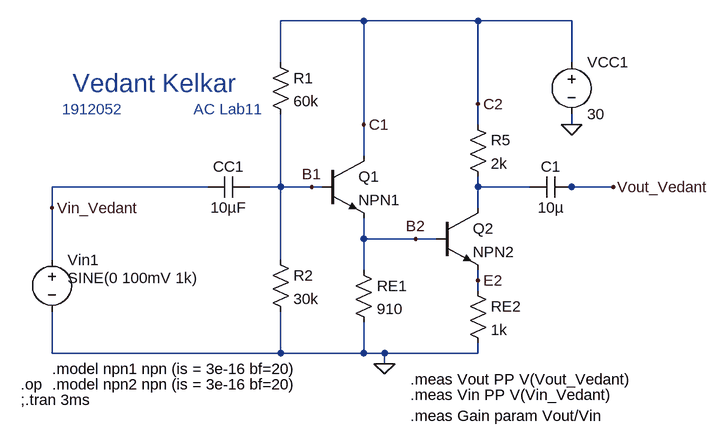
[diagram p0: schematic AC_Lab11.asc]
AC_Lab11.asc, the LTspice schematic file:
Version 4
SHEET 1 880 680
WIRE 176 -176 48 -176
WIRE 352 -176 176 -176
WIRE 496 -176 352 -176
WIRE 48 -112 48 -176
WIRE 496 -112 496 -176
WIRE 352 -48 352 -176
WIRE 176 -16 176 -176
WIRE 352 -16 352 -48
WIRE 496 -16 496 -32
WIRE 176 32 176 -16
WIRE -64 80 -304 80
WIRE 48 80 48 -32
WIRE 48 80 0 80
WIRE 96 80 48 80
WIRE 112 80 96 80
WIRE 352 80 352 64
WIRE 432 80 352 80
WIRE 496 80 480 80
WIRE 560 80 496 80
WIRE -304 112 -304 80
WIRE 352 112 352 80
WIRE 176 160 176 128
WIRE 256 160 176 160
WIRE 288 160 256 160
WIRE -304 192 -304 112
WIRE 48 192 48 80
WIRE 176 208 176 160
WIRE 352 224 352 208
WIRE 352 240 352 224
WIRE -304 336 -304 272
WIRE 48 336 48 272
WIRE 48 336 -304 336
WIRE 176 336 176 288
WIRE 176 336 48 336
WIRE 208 336 176 336
WIRE 352 336 352 320
WIRE 352 336 208 336
WIRE 208 352 208 336
FLAG 496 -16 0
FLAG 208 352 0
FLAG -304 112 Vin_Vedant
FLAG 560 80 Vout_Vedant
FLAG 96 80 B1
FLAG 176 -16 C1
FLAG 352 -48 C2
FLAG 256 160 B2
FLAG 352 224 E2
SYMBOL res 32 -128 R0
SYMATTR InstName R1
SYMATTR Value 60k
SYMBOL res 32 176 R0
SYMATTR InstName R2
SYMATTR Value 30k
SYMBOL npn 288 112 R0
SYMATTR InstName Q2
SYMATTR Value NPN2
SYMBOL cap 0 64 R90
WINDOW 0 0 32 VBottom 2
WINDOW 3 32 32 VTop 2
SYMATTR InstName CC1
SYMATTR Value 10µF
SYMBOL voltage -304 176 R0
WINDOW 123 24 124 Left 2
WINDOW 39 0 0 Left 0
WINDOW 3 24 44 Left 2
SYMATTR Value SINE(0 100mV 1k)
SYMATTR InstName Vin1
SYMBOL voltage 496 -128 R0
SYMATTR InstName VCC1
SYMATTR Value 30
SYMBOL npn 112 32 R0
SYMATTR InstName Q1
SYMATTR Value NPN1
SYMBOL res 336 224 R0
SYMATTR InstName RE2
SYMATTR Value 1k
SYMBOL cap 496 64 R90
WINDOW 0 0 32 VBottom 2
WINDOW 3 32 32 VTop 2
SYMATTR InstName C1
SYMATTR Value 10µ
SYMBOL res 160 192 R0
SYMATTR InstName RE1
SYMATTR Value 910
SYMBOL res 336 -32 R0
SYMATTR InstName R5
SYMATTR Value 2k
TEXT -272 -80 Left 4 ;Vedant Kelkar
TEXT -288 -40 Left 2 ;1912052                AC Lab11
TEXT -304 360 Left 2 !.model npn1 npn (is = 3e-16 bf=20)
TEXT -352 384 Left 2 !.op
TEXT -304 384 Left 2 !.model npn2 npn (is = 3e-16 bf=20)
TEXT -352 408 Left 2 !;.tran 3ms
TEXT 248 376 Left 2 !.meas Vout PP V(Vout_Vedant)
TEXT 248 400 Left 2 !.meas Vin PP V(Vin_Vedant)
TEXT 248 432 Left 2 !.meas Gain param Vout/Vin

The netlist it stands for:
* AC_Lab11.asc
R1 C2 B1 60k
R2 B1 0 30k
Q2 N001 B2 E2 0 NPN2
CC1 B1 Vin_Vedant 10µF
Vin1 Vin_Vedant 0 SINE(0 100mV 1k)
VCC1 C2 0 30
Q1 C2 B1 B2 0 NPN1
RE2 E2 0 1k
C1 Vout_Vedant N001 10µ
RE1 B2 0 910
R5 C2 N001 2k
.model NPN NPN
.model PNP PNP
.lib standard.bjt
* Vedant Kelkar
* 1912052                AC Lab11
.model npn1 npn (is = 3e-16 bf=20)
.op
.model npn2 npn (is = 3e-16 bf=20)
;.tran 3ms
.meas Vout PP V(Vout_Vedant)
.meas Vin PP V(Vin_Vedant)
.meas Gain param Vout/Vin
.backanno
.end